# EAGLE design smartBadgeV1 (EAGLE 9.4.1)
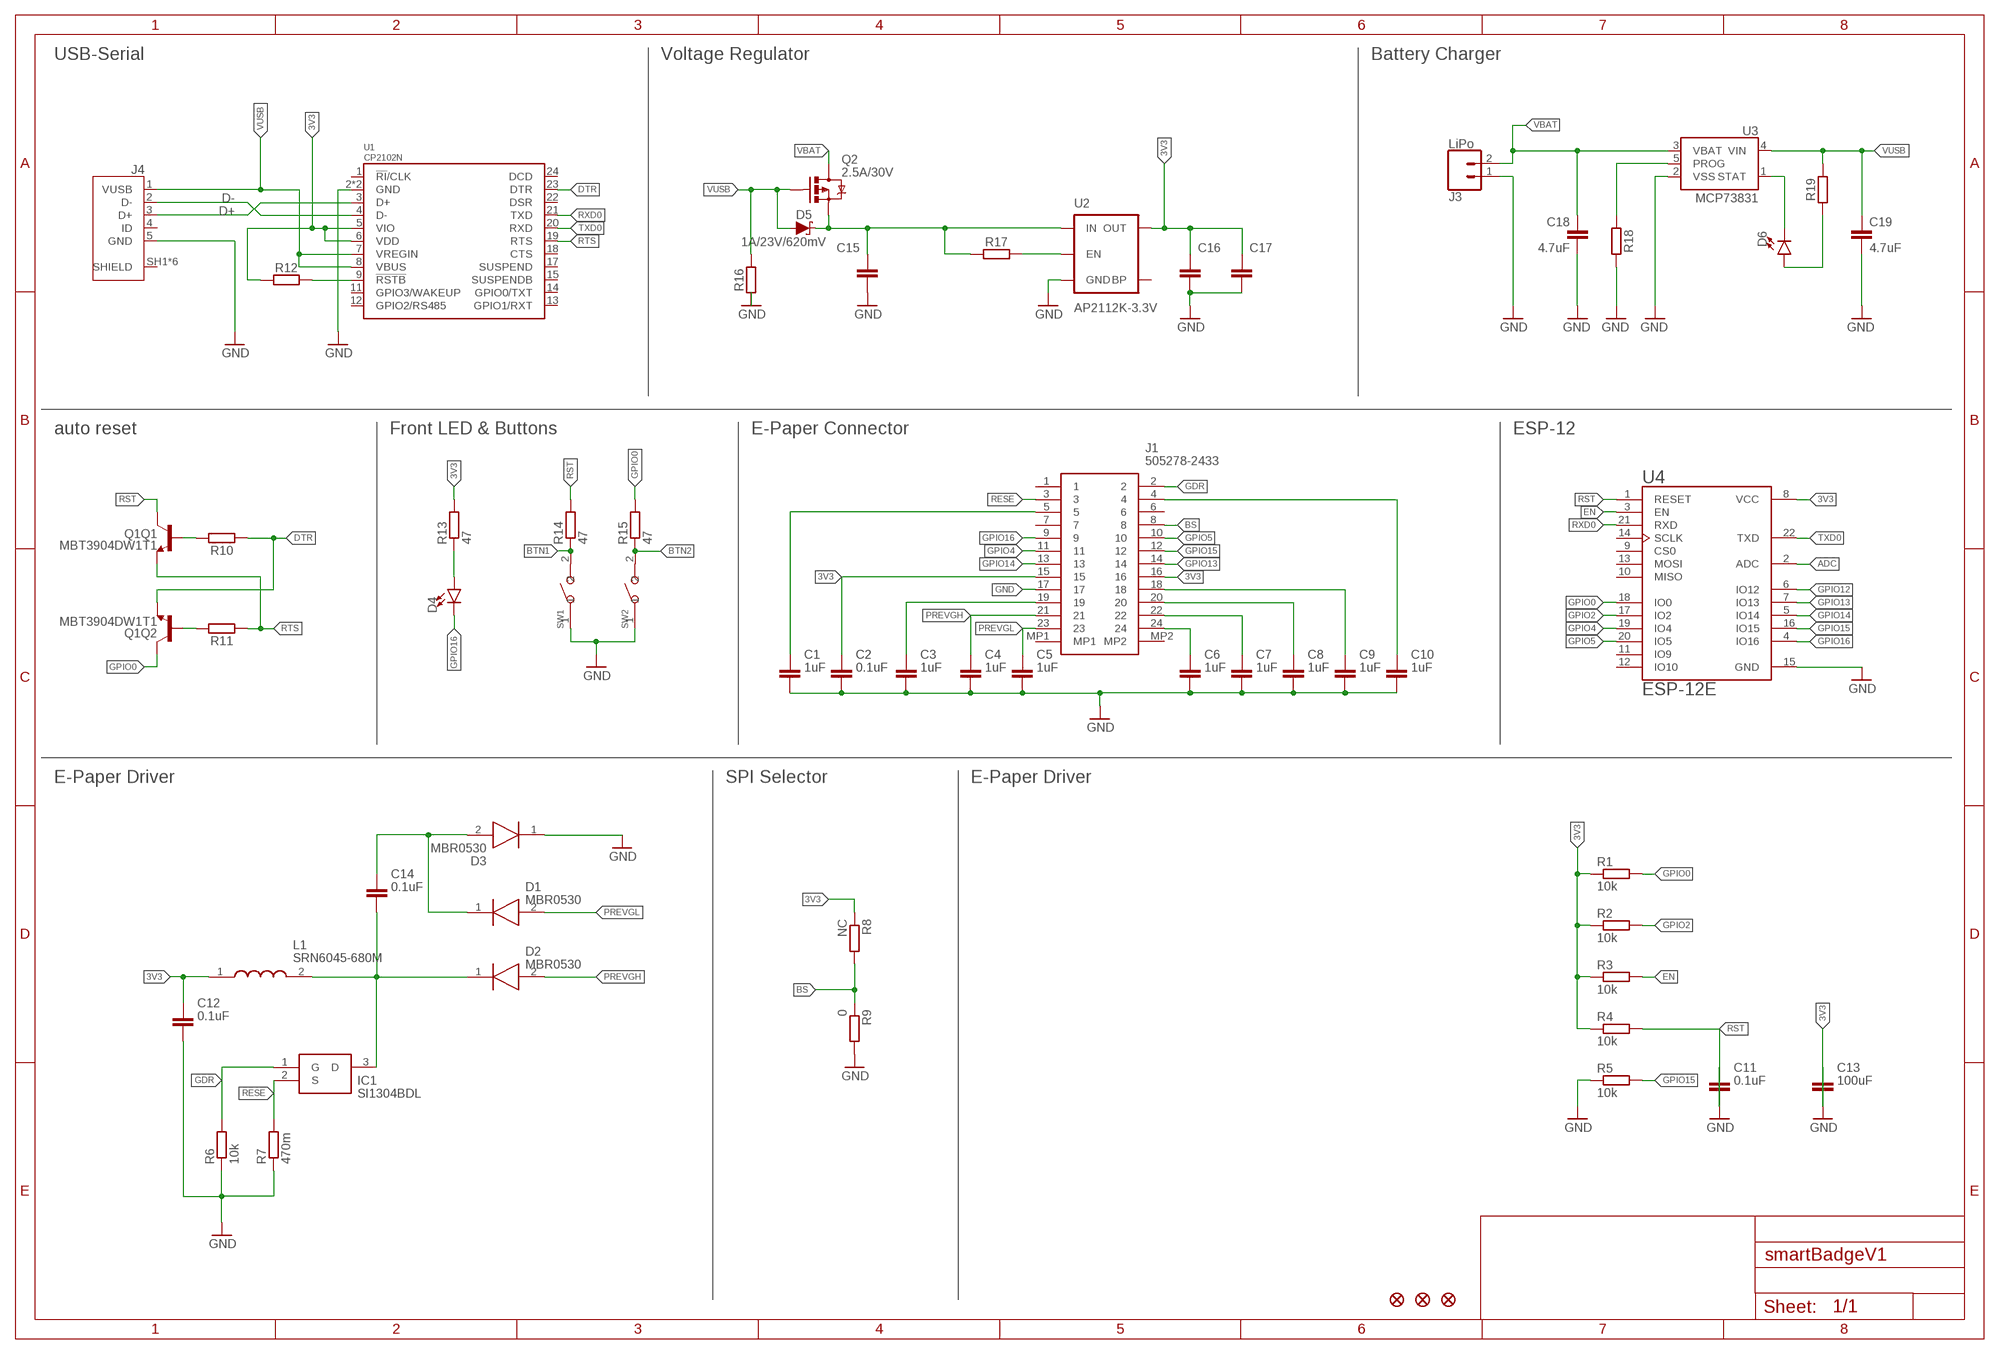
[diagram p0: schematic, sheet 1]

## Parts
C1  1uF  C-EUC0603  [C0603]
C2  0.1uF  C-EUC0603  [C0603]
C3  1uF  C-EUC0603  [C0603]
C4  1uF  C-EUC0603  [C0603]
C5  1uF  C-EUC0603  [C0603]
C6  1uF  C-EUC0603  [C0603]
C7  1uF  C-EUC0603  [C0603]
C8  1uF  C-EUC0603  [C0603]
C9  1uF  C-EUC0603  [C0603]
C10  1uF  C-EUC0603  [C0603]
C11  0.1uF  C-EUC0603  [C0603]
C12  0.1uF  C-EUC0603  [C0603]
C13  100uF  C-EUC1206  [C1206]
C14  0.1uF  C-EUC0603  [C0603]
C15  1uF  C-EUC0603  [C0603]
C16  1uF  C-EUC0603  [C0603]
C17  10uF  C-EUC0603  [C0603]
C18  4.7uF  4.7UF0603  [0603]
C19  4.7uF  4.7UF0603  [0603]
D1  MBR0530  [SOD3716X135N]
D2  MBR0530  [SOD3716X135N]
D3  MBR0530  [SOD3716X135N]
D4  led-blue-0603  LEDCHIP-LED0603  [CHIP-LED0603]
D5  1A/23V/620mV  DIODE-SCHOTTKY-BAT20J  [SOD-323]
D6  led-blue-0603  LEDCHIP-LED0603  [CHIP-LED0603]
FD1  FIDUCIAL1X2  [FIDUCIAL-1X2]
FD2  FIDUCIAL1X2  [FIDUCIAL-1X2]
FD3  FIDUCIAL1X2  [FIDUCIAL-1X2]
IC1  SI1304BDL  SI1304BDL-T1-E3  [SOT65P210X110-3N]
J1  505278-2433  [5052782433]
J3  LiPo  CONN_02-JST-2MM-SMT  [JST-2-SMD]
J4  10118192-0001LF  [AMPHENOL_10118192-0001LF]
L1  SRN6045-680M  [INDPM6060X470N]
Q1  MBT3904DW1T1  TRANS_NPN_DUAL-MBT3904DW1T1  [SC70-6]
Q2  2.5A/30V  MOSFET-PCHANNELDMG2307L  [SOT23-3@1]
R1  10k  R-EU_R0603  [R0603]
R2  10k  R-EU_R0603  [R0603]
R3  10k  R-EU_R0603  [R0603]
R4  10k  R-EU_R0603  [R0603]
R5  10k  R-EU_R0603  [R0603]
R6  10k  R-EU_R0603  [R0603]
R7  470m  R-EU_R0603  [R0603]
R8  NC  R-EU_R0603  [R0603]
R9  0  R-EU_R0603  [R0603]
R10  10k  R-EU_R0603  [R0603]
R11  10k  R-EU_R0603  [R0603]
R12  1k  R-EU_R0603  [R0603]
R13  47  R-EU_R0603  [R0603]
R14  47  R-EU_R0603  [R0603]
R15  47  R-EU_R0603  [R0603]
R16  10k  R-EU_R0603  [R0603]
R17  100K  R-EU_R0603  [R0603]
R18  2.0k  R-EU_R0603  [R0603]
R19  1k  R-EU_R0603  [R0603]
SW1  SMD-BUTTON(2P-3.0X2.5X1.2+0.4MM)-B3U-1000P-2P-SMD  [SW2-2.6-3.0X2.5X1.2+0.4MM]
SW2  SMD-BUTTON(2P-3.0X2.5X1.2+0.4MM)-B3U-1000P-2P-SMD  [SW2-2.6-3.0X2.5X1.2+0.4MM]
U1  CP2102N  [QFN24]
U2  AP2112K-3.3V  V_REG_LDOSMD  [SOT23-5]
U3  MCP73831  [SOT23-5]
U4  ESP-12E  ESP8266-12E/ESP-12E  [XCVR_ESP8266-12E/ESP-12E]

## Nets
3V3 [VDD]: C2.1 C12.1 C13.2 C16.1 C17.1 J1.15 J1.16 L1.1 R1.1 R2.1 R3.1 R4.1 R8.1 R12.1 R13.2 U1.5(VIO) U1.6(VDD) U2.5(OUT) U4.8(VCC)
ADC: U4.2(ADC)
BS: J1.8 R8.2 R9.1
BTN1: R14.1 SW1.2
BTN2: R15.1 SW2.2
CHG: D6.C U3.1(STAT)
D+: J4.3(D+) U1.3(D+)
D-: J4.2(D-) U1.4(D-)
DTR: Q1.1(Q2:E) R10.1 U1.23(DTR)
EN: R3.2 U4.3(EN)
EN1: R17.2 U2.3(EN)
GDR: IC1.1(G) J1.2 R6.2
GND [gnd]: C1.2 C2.2 C3.2 C4.2 C5.2 C6.2 C7.2 C8.2 C9.2 C10.2 C11.1 C12.2 C13.1 C15.2 C16.2 C17.2 C18.2 C19.2 D3.1(K) J1.17 J3.1 J4.5(GND) R5.1 R6.1 R7.1 R9.2 R16.1 R18.1 SW1.1 SW2.1 U1.2(GND) U1.PAD(GND) U2.2(GND) U3.2(VSS) U4.15(GND)
GPIO0: Q1.6(Q2:C) R1.2 R15.2 U4.18(IO0)
GPIO2: R2.2 U4.17(IO2)
GPIO4: J1.11 U4.19(IO4)
GPIO5: J1.10 U4.20(IO5)
GPIO12: U4.6(IO12)
GPIO13: J1.14 U4.7(IO13)
GPIO14: J1.13 U4.5(IO14)
GPIO15: J1.12 R5.2 U4.16(IO15)
GPIO16: D4.C J1.9 U4.4(IO16)
N$1: R12.2 U1.9(!RSTB)
N$4: D6.A R19.2
N$5: R18.2 U3.5(PROG)
N$6: Q1.5(Q1:B) R10.2
N$7: D4.A R13.1
N$15: C1.1 J1.5
N$16: C10.1 J1.4
N$17: C14.1 D1.1(K) D3.2(A)
N$18: C14.2 D2.1(K) IC1.3(D) L1.2
N$21: C15.1 D5.C Q2.2(S) R17.1 U2.1(IN)
N$22: Q1.2(Q2:B) R11.2
N$24: C9.1 J1.18
N$25: C8.1 J1.20
N$26: C7.1 J1.22
N$27: C6.1 J1.24
N$33: C3.1 J1.19
PREVGH: C4.1 D2.2(A) J1.21
PREVGL: C5.1 D1.2(A) J1.23
RESE: IC1.2(S) J1.3 R7.2
RST: C11.2 Q1.3(Q1:C) R4.2 R14.2 U4.1(RESET)
RTS: Q1.4(Q1:E) R11.1 U1.19(RTS)
RXD0: U1.21(TXD) U4.21(RXD)
TXD0: U1.20(RXD) U4.22(TXD)
VBAT [VDD]: C18.1 J3.2 Q2.3(D) U3.3(VBAT)
VUSB [VDD]: C19.1 D5.A J4.1(VUSB) Q2.1(G) R16.2 R19.1 U1.7(VREGIN) U1.8(VBUS) U3.4(VIN)
Unconnected: J1.1 J1.6 J1.7 J1.MP1 J1.MP2 J4.4(ID) J4.SH1(SHIELD) J4.SH2(SHIELD) J4.SH3(SHIELD) J4.SH4(SHIELD) J4.SH5(SHIELD) J4.SH6(SHIELD) U1.1(!RI!/CLK) U1.11(GPIO3/WAKEUP) U1.12(GPIO2/RS485) U1.13(GPIO1/RXT) U1.14(GPIO0/TXT) U1.15(SUSPENDB) U1.17(SUSPEND) U1.18(CTS) U1.22(DSR) U1.24(DCD) U2.4(BP) U4.9(CS0) U4.10(MISO) U4.11(IO9) U4.12(IO10) U4.13(MOSI) U4.14(SCLK)

## Notes on the sheet
- USB-Serial | Voltage Regulator | Battery Charger
- auto reset | Front LED & Buttons | E-Paper Connector | ESP-12
- E-Paper Driver | SPI Selector | E-Paper Driver

## Library data of the parts
C1-C17 = resistor:C-EU: CAPACITOR, European symbol
C18 C19 = SparkFun-Capacitors:4.7UF: 4.7µF ceramic capacitors A capacitor is a passive two-terminal electrical component used to store electrical energy temporarily in an electric field.; PROD_ID: CAP-08280
D1-D3 = SamacSys_Parts:MBR0530: ON SEMICONDUCTOR - MBR0530 - DIODE, SCHOTTKY, 0.5A, 30V, SOD-123 Source: Datasheet <https://www.mouser.com/datasheet/2/308/MBR0530-1301245.pdf>; DESCRIPTION: ON SEMICONDUCTOR - MBR0530 - DIODE, SCHOTTKY, 0.5A, 30V, SOD-123; HEIGHT: 1.35mm; MANUFACTURER_NAME: ON Semiconductor; MANUFACTURER_PART_NUMBER: MBR0530; MOUSER_PART_NUMBER: 512-MBR0530
D4 D6 = led:LED: LED OSRAM: - CHIPLED LG R971, LG N971, LY N971, LG Q971, LY Q971, LO R971, LY R971 LH N974, LH R974 LS Q976, LO Q976, LY Q976 LO Q996 - Hyper CHIPLED LW Q18S LB Q993, LB Q99A, LB R99A - SideLED LS A670, LO A670, LY A670, LG A670, LP A670 LB A673, LV A673, LT A673, LW A673 LH A674 LY A675 LS A676, LA A676, LO A676, LY A676, LW A676 LS A679, LY A679, LG A679 - Hyper Micro SIDELED® LS Y876, LA Y876, LO Y876, LY Y876 LT Y87S - SmartLED LW L88C, LW L88S LB L89C, LB L89S, LG L890 LS L89K, LO L89K, LY L89K LS L896, LA L896, LO L896, LY L896 - TOPLED LS T670, LO T670, LY T670, LG T670, LP T670 LSG T670, LSP T670, LSY T670, LOP T670, LYG T670 LG T671, LOG T671, LSG T671 LB T673, LV T673, LT T673, LW T673 LH T674 LS T676, LA T676, LO T676, LY T676, LB T676, LH T676, LSB T676, LW T676 LB T67C, LV T67C, LT T67C, LS T67K, LO T67K, LY T67K, LW E67C LS E67B, LA E67B, LO E67B, LY E67B, LB E67C, LV E67C, LT E67C LW T67C LS T679, LY T679, LG T679 LS T770, LO T770, LY T770, LG T770, LP T770 LB T773, LV T773, LT T773, LW T773 LH T774 LS E675, LA E675, LY E675, LS T675 LS T776, LA T776, LO T776, LY T776, LB T776 LHGB T686 LT T68C, LB T68C - Hyper Mini TOPLED® LB M676 - Mini TOPLED Santana® LG M470 LS M47K, LO M47K, LY M47K Source: http://www.osram.convergy.de LUXEON: - LUMILED® LXK2-PW12-R00, LXK2-PW12-S00, LXK2-PW14-U00, LXK2-PW14-V00 LXK2-PM12-R00, LXK2-PM12-S00, LXK2-PM14-U00 LXK2-PE12-Q00, LXK2-PE12-R00, LXK2-PE12-S00, LXK2-PE14-T00, LXK2-PE14-U00 LXK2-PB12-K00, LXK2-PB12-L00, LXK2-PB12-M00, LXK2-PB14-N00, LXK2-PB14-P00, LXK2-PB14-Q00 LXK2-PR12-L00, LXK2-PR12-M00, LXK2-PR14-Q00, LXK2-PR14-R00 LXK2-PD12-Q00, LXK2-PD12-R00, LXK2-PD12-S00 LXK2-PH12-R00, LXK2-PH12-S00 LXK2-PL12-P00, LXK2-PL12-Q00, LXK2-PL12-R00 Source: www.luxeon.com KINGBRIGHT: KA-3528ASYC Source: www.kingbright.com
D5 = SparkFun-DiscreteSemi:DIODE-SCHOTTKY: Schottky diode A Schottky diode is a semiconductor diode which has a low forward voltage drop and a very fast switching action.; PROD_ID: DIO-11623
FD1-FD3 = SparkFun-Aesthetics:FIDUCIAL: Fiducial Alignment Points Point-of-reference for pick-and-place machines and other optical instruments.
IC1 = SamacSys_Parts:SI1304BDL-T1-E3: SI1304BDL-T1-E3, N-channel MOSFET Transistor 0.85 A 30 V, 3-Pin SC-70 Source: Datasheet <https://componentsearchengine.com/Datasheets/1/SI1304BDL-T1-E3.pdf>; DESCRIPTION: SI1304BDL-T1-E3, N-channel MOSFET Transistor 0.85 A 30 V, 3-Pin SC-70; HEIGHT: 1.1mm; MANUFACTURER_NAME: Vishay; MANUFACTURER_PART_NUMBER: SI1304BDL-T1-E3; MOUSER_PART_NUMBER: 781-SI1304BDL-E3; MOUSER_PRICE-STOCK: https://www.mouser.com/Search/Refine.aspx?Keyword=781-SI1304BDL-E3
J1 = SamacSys_Parts:505278-2433: FFC & FPC Connectors 0.5 FFC ZIF BTM CONT 24Ckt R/A FRONT FLIP Source: Datasheet <https://componentsearchengine.com/Datasheets/1/505278-2433.pdf>; DESCRIPTION: FFC & FPC Connectors 0.5 FFC ZIF BTM CONT 24Ckt R/A FRONT FLIP; HEIGHT: 2.15mm; MANUFACTURER_NAME: Molex; MANUFACTURER_PART_NUMBER: 505278-2433; MOUSER_PART_NUMBER: 538-505278-2433; MOUSER_PRICE-STOCK: https://www.mouser.com/Search/Refine.aspx?Keyword=538-505278-2433
J3 = SparkFun-Connectors:CONN_02: Multi connection point. Often used as Generic Header-pin footprint for 0.1 inch spaced/style header connections On any of the 0.1 inch spaced packages, you can populate with these: Break Away Headers - Straight <https://www.sparkfun.com/products/116> (PRT-00116) Break Away Male Headers - Right Angle <https://www.sparkfun.com/products/553> (PRT-00553) Female Headers <https://www.sparkfun.com/products/115> (PRT-00115) Break Away Headers - Machine Pin <https://www.sparkfun.com/products/117> (PRT-00117) Break Away Female Headers - Swiss Machine Pin <https://www.sparkfun.com/products/743> (PRT-00743) For SCREWTERMINALS and SPRING TERMINALS visit here: Screw Terimnals on SparkFun.com <https://www.sparkfun.com/search/results?term=Screw+Terminals> (5mm/3.5mm/2.54mm spacing) This device is also useful as a general connection point to wire up your design to another part of your project. Our various solder wires solder well into these plated through hole pads. Hook-Up Wire - Assortment (Stranded, 22 AWG) <https://www.sparkfun.com/products/11375> (PRT-11375) Hook-Up Wire - Assortment (Solid Core, 22 AWG) <https://www.sparkfun.com/products/11367> (PRT-11367) View the entire wire category on our website here <https://www.sparkfun.com/categories/141> Special notes: Molex polarized connector foot print use with: PRT-08233 with associated crimp pins and housings. 2.54_SCREWTERM for use with PRT-10571. 3.5mm Screw Terminal footprints for PRT-08084 5mm Screw Terminal footprints for use with PRT-08432; PROD_ID: CONN-11443
J4 = 10118192-0001LF:10118192-0001LF: Single Port 5 Contact Horizontal Right Angle Shielded Micro B USB 2.0 Connector; AVAILABILITY: Unavailable; DESCRIPTION: Single Port 5 Contact Horizontal Right Angle Shielded Micro B USB 2.0 Connector; MF: Amphenol ICC; MP: 10118192-0001LF; PACKAGE: None; PRICE: None
L1 = SamacSys_Parts:SRN6045-680M: Bourns SRN6045 Series Type 6045 Shielded Wire-wound SMD Inductor with a Ferrite Core, 68 H +/-20% Wire-Wound 1A Idc Source: Datasheet <https://www.mouser.de/datasheet/2/54/rn6045-1391386.pdf>; DESCRIPTION: Bourns SRN6045 Series Type 6045 Shielded Wire-wound SMD Inductor with a Ferrite Core, 68 H +/-20% Wire-Wound 1A Idc; HEIGHT: 4.7mm; MANUFACTURER_NAME: Bourns; MANUFACTURER_PART_NUMBER: SRN6045-680M
Q1 = SparkFun-DiscreteSemi:TRANS_NPN_DUAL: Dual NPN Transistors in Single Package The MBT3904W1 puts two general purpose 3904 NPN transistors in a single package. Datasheet <http://www.onsemi.com/pub_link/Collateral/MBT3904DW1T1-D.PDF> SparkFun Products: SparkFun ESP32 Thing <https://www.sparkfun.com/products/13907>; PROD_ID: TRANS-13337
Q2 = SparkFun-DiscreteSemi:MOSFET-PCHANNEL: Generic PMOSFET IRLML2244 - TRANS-11153 (SOT-23 -20V -4.3A) (1.Gate 2.Source 3.Drain) FQP27P06 - COM-10349 <http://www.sparkfun.com/products/10349> (TO-220 -60V -27A) (1.Gate 2.Source 3.Drain); PROD_ID: TRANS-11308
R1-R19 = resistor:R-EU_: RESISTOR, European symbol
SW1 = OPL_Switch:SMD-BUTTON(2P-3.0X2.5X1.2+0.4MM): 311020047; MPN: B3U-1000P-2P-SMD; ORDERNO: B3U-1000P; VALUE: B3U-1000P-2P-SMD
SW2 = OPL_Switch:SMD-BUTTON(2P-3.0X2.5X1.2+0.4MM): 311020047; MPN: B3U-1000P-2P-SMD; VALUE: B3U-1000P-2P-SMD
U1 = SparkFun-IC-Comms:CP2102N; PROD_ID: IC-14020
U2 = SparkFun-PowerIC:V_REG_LDO: Voltage Regulator LDO Standard 150mA LDO voltage regulator in SOT-23 layout. Micrel part MIC5205. BP (by-pass) pin is used to lower output noise with 470pF cap.; PROD_ID: VREG-12457
U3 = SparkFun-PowerIC:MCP73831: Miniature single cell, fully integrated Li-Ion, Li-polymer charge management controller http://ww1.microchip.com/downloads/en/DeviceDoc/20001984g.pdf IC-09995; PROD_ID: IC-09995
U4 = ESP8266-12E_ESP-12E:ESP8266-12E/ESP-12E: ESP-12E WiFi Module; AVAILABILITY: Unavailable; DESCRIPTION: This WiFi module has a 32-bit MCU micro and clock speeds supporting 80 MHz or 160 MHz. Supports the RTOS and integrated Wi-Fi MAC/BB/RF/PA/LNA, and has an on-board antenna.; MF: AI-Thinker; MP: ESP8266-12E/ESP-12E; PACKAGE: None; PRICE: None

## Net classes
0 default: width 0.127 mm
1 gnd: width 0.381 mm
2 VDD: width 0.381 mm

## Board
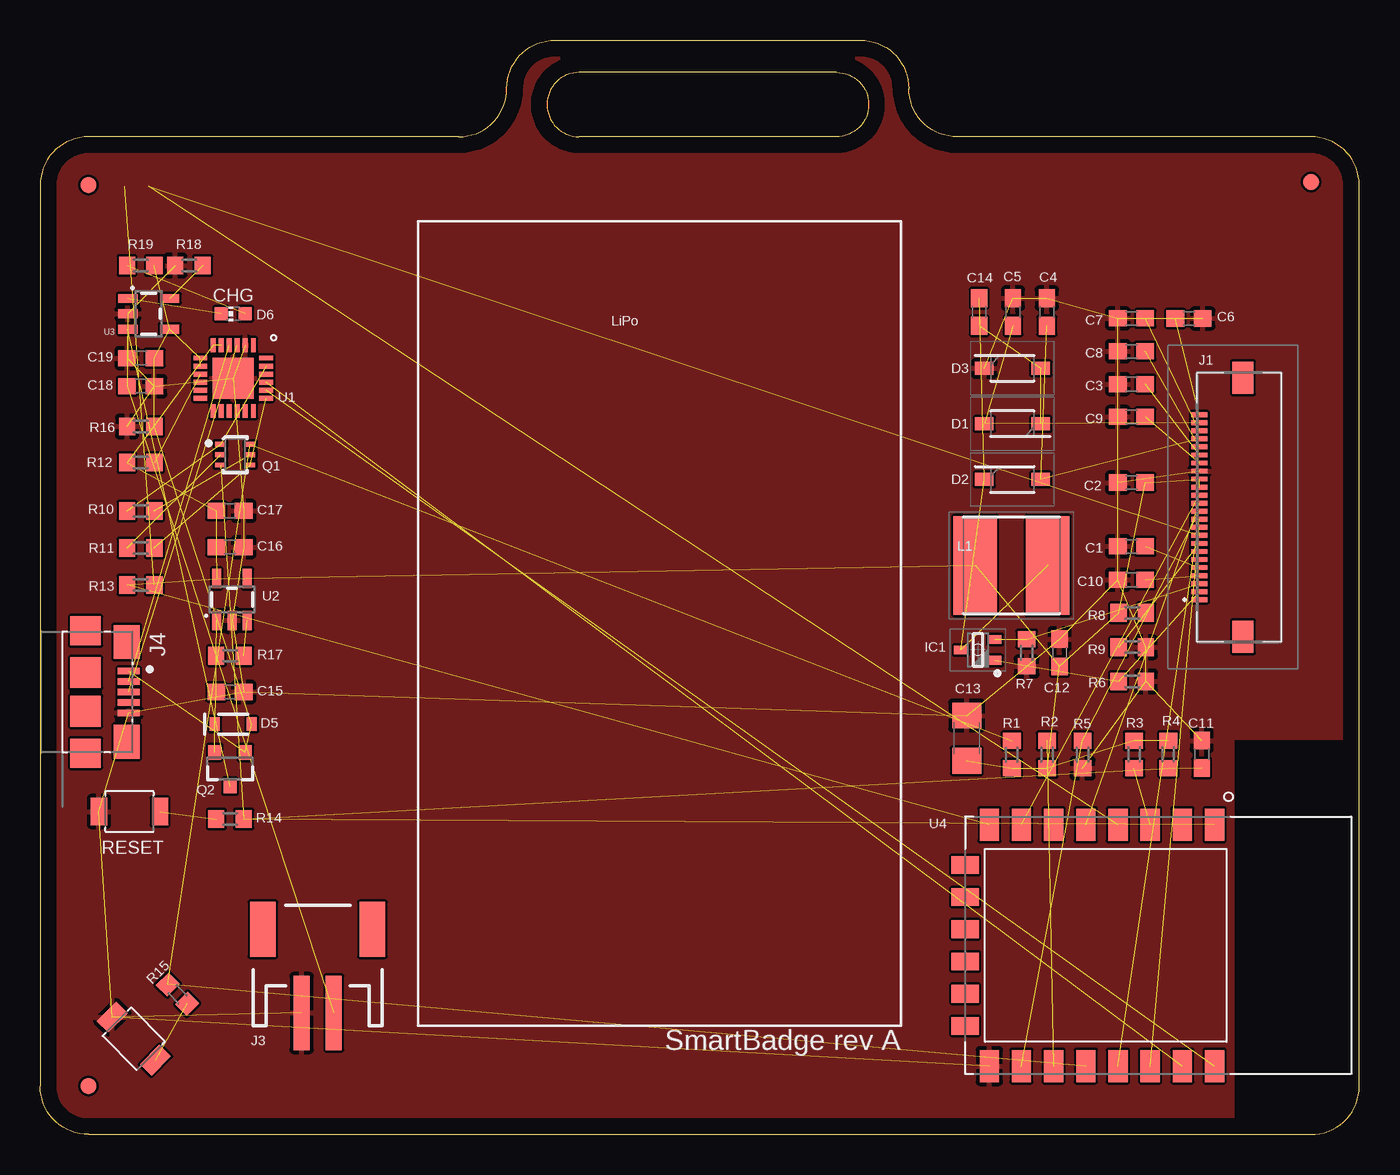
[diagram p1: board, top side]
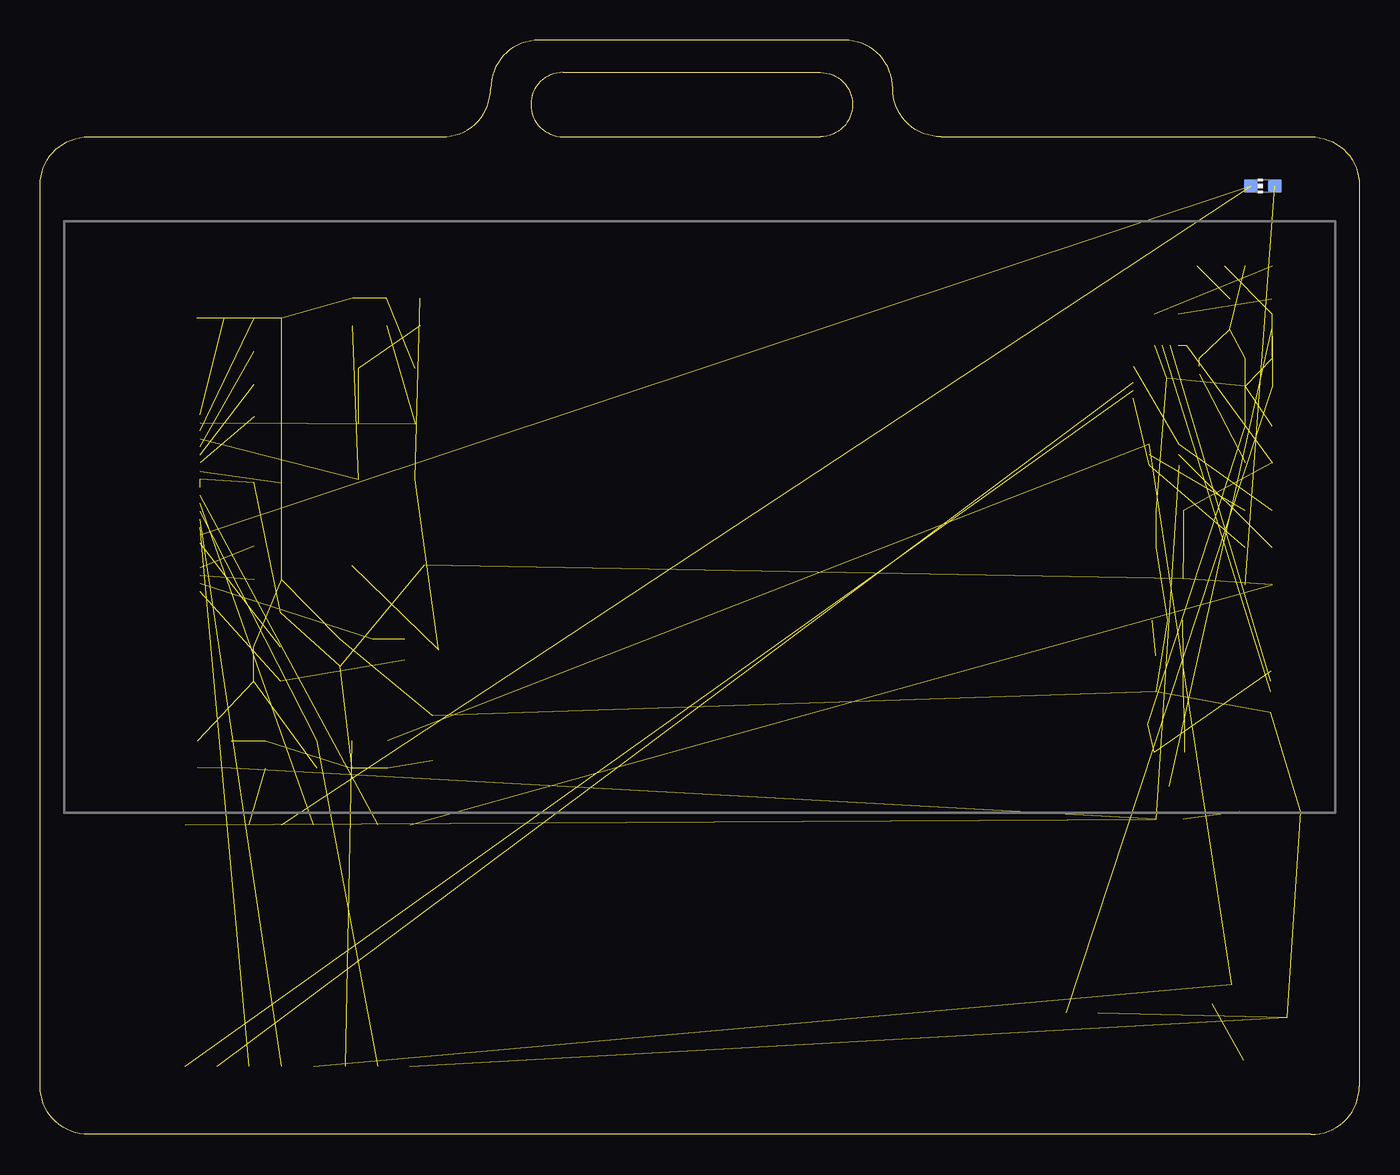
[diagram p2: board, bottom side, seen from below]

Size 82 x 68 mm. Coordinates in mm from the lower left corner, seen from the top.
Outline: 3,0 79,0 arc90 82,3 82,59 arc90 79,62 57,62 arc-90 54,65 arc90 51,68 32,68 arc90 29,65 arc-90 26,62 3,62 arc90 0,59 0,3 arc90 3,0
Outline: 49.5,62 33.5,62 arc-180 33.5,66 49.5,66 arc-180 49.5,62
Copper layers (1*16): Top 0.035mm / dielectric 1.5mm / Bottom 0.035mm
Design rules "default": minimum track width 6mil, minimum drill 0.35mm, track to track 6mil, track to pad 6mil, pad to pad 6mil, via to via 6mil, smd to smd 6mil, copper to edge 40mil, drill to drill 6mil, minimum pad ring 10mil, minimum via ring 8mil, stop-mask expansion 4mil, vias tented up to drill 0mil, thermal gap 10mil
tRestrict: area 74.2,-0.8 to 83.2,24.5
bRestrict: area 74.2,-0.8 to 83.2,24.5

### Footprints (pad centres in the part's own frame; a part is rotated, then mirrored left to right if it is on the bottom)
C0603 = smd 1.1 x 1: 1 -0.85,0; 2 0.85,0
C1206 = smd 1.6 x 1.8: 1 -1.4,0; 2 1.4,0
0603 = smd 1.1 x 1: 1 -0.85,0; 2 0.85,0
SOD3716X135N = smd 1.15 x 0.8: 1 -1.75,0; 2 1.75,0
CHIP-LED0603 = smd 0.8 x 0.8: A 0,-0.75; C 0,0.75
SOD-323 = smd 0.63 x 0.83: A 1.15,0; C -1.15,0
FIDUCIAL-1X2 = smd 1 x 1: 1 0,0
SOT65P210X110-3N = smd 0.85 x 0.55: 1 -1.05,0.65; 2 -1.05,-0.65; 3 1.05,0
5052782433 = smd 0.3 x 1: 1 -5.75,2.475; 2 -5.25,2.475; 3 -4.75,2.475; 4 -4.25,2.475; 5 -3.75,2.475; 6 -3.25,2.475; 7 -2.75,2.475; 8 -2.25,2.475; 9 -1.75,2.475; 10 -1.25,2.475; 11 -0.75,2.475; 12 -0.25,2.475; 13 0.25,2.475; 14 0.75,2.475; 15 1.25,2.475; 16 1.75,2.475; 17 2.25,2.475; 18 2.75,2.475; 19 3.25,2.475; 20 3.75,2.475; 21 4.25,2.475; 22 4.75,2.475; 23 5.25,2.475; 24 5.75,2.475 | smd 2 x 1.3: MP1 -8.05,-0.225; MP2 8.05,-0.225
JST-2-SMD = smd 1 x 4.6: 1 -1,-3.7; 2 1,-3.7 | smd 1.6 x 3.4: NC1 -3.4,1.5; NC2 3.4,1.5
AMPHENOL_10118192-0001LF = smd 0.4 x 1.35: 1 -1.3,0; 2 -0.65,0; 3 0,0; 4 0.65,0; 5 1.3,0 | smd 2.1 x 1.6: SH1 -3.1,-0.125; SH2 3.1,-0.125 | smd 1.8 x 1.9: SH3 -3.8,-2.675; SH6 3.8,-2.675 | smd 1.9 x 1.9: SH4 -1.2,-2.675; SH5 1.2,-2.675
INDPM6060X470N = smd 2.7 x 6.1: 1 -2.25,0; 2 2.25,0
SC70-6 = smd 0.3 x 0.66: 1 -0.65,-0.92; 2 0,-0.92; 3 0.65,-0.92; 4 0.65,0.92; 5 0,0.92; 6 -0.65,0.92
SOT23-3@1 = smd 0.8 x 0.9: 1 -0.95,-1; 2 0.95,-1; 3 0,1.1
R0603 = smd 1 x 1.1: 1 -0.85,0; 2 0.85,0
SW2-2.6-3.0X2.5X1.2+0.4MM = smd 1 x 1.7: 1 -1.9,0; 2 1.9,0
QFN24 = smd 0.85 x 0.3: 1 -2.05,1.25; 2 -2.05,0.75; 3 -2.05,0.25; 4 -2.05,-0.25; 5 -2.05,-0.75; 6 -2.05,-1.25; 13 2.05,-1.25; 14 2.05,-0.75; 15 2.05,-0.25; 16 2.05,0.25; 17 2.05,0.75; 18 2.05,1.25 | smd 0.3 x 0.85: 7 -1.25,-2.05; 8 -0.75,-2.05; 9 -0.25,-2.05; 10 0.25,-2.05; 11 0.75,-2.05; 12 1.25,-2.05; 19 1.25,2.05; 20 0.75,2.05; 21 0.25,2.05; 22 -0.25,2.05; 23 -0.75,2.05; 24 -1.25,2.05 | smd 2.55 x 2.55: PAD 0,0
SOT23-5 = smd 0.55 x 1.2: 1 -0.95,-1.3; 2 0,-1.3; 3 0.95,-1.3; 4 0.95,1.3; 5 -0.95,1.3
XCVR_ESP8266-12E/ESP-12E = smd 2 x 1.2: 1 -7.5,7; 2 -7.5,5; 3 -7.5,3; 4 -7.5,1; 5 -7.5,-1; 6 -7.5,-3; 7 -7.5,-5; 8 -7.5,-7; 15 7.5,-7; 16 7.5,-5; 17 7.5,-3; 18 7.5,-1; 19 7.5,1; 20 7.5,3; 21 7.5,5; 22 7.5,7 | smd 1.1 x 1.7: 9 -5,-8.5; 10 -3,-8.5; 11 -1,-8.5; 12 1,-8.5; 13 3,-8.5; 14 5,-8.5

### Placement (x,y rotation side)
C1  67.84,36.55 180 top
C2  67.84,40.51 180 top
C3  67.84,46.63 180 top
C4  62.58,51.11 90 top
C5  60.48,51.11 90 top
C6  71.41,50.71 0 top
C7  67.84,50.71 180 top
C8  67.84,48.67 180 top
C9  67.84,44.59 180 top
C10  67.84,34.47 180 top
C11  72.2,23.63 270 top
C12  63.37,29.94 90 top
C13  57.6,24.63 270 top
C14  58.37,51.11 90 top
C15  11.8,27.5 0 top
C16  11.8,36.5 0 top
C17  11.8,38.75 0 top
C18  6.25,46.5 0 top
C19  6.25,48.25 180 top
D1  60.44,44.16 180 top
D2  60.44,40.71 0 top
D3  60.44,47.61 0 top
D4  6,58.94 90 bottom
D5  12,25.5 0 top
D6  12,51 90 top
FD1  3,59 0 top
FD2  3,3 0 top
FD3  79.01,59.19 0 top
IC1  58.29,30.11 180 top
J1  74.54,38.98 90 top
J3  17.25,11.25 0 top
J4  5.5,27.5 270 top
L1  60.38,35.36 0 top
Q1  12.13,42.25 270 top
Q2  11.8,22.75 180 top
R1  60.4,23.61 90 top
R2  62.6,23.61 90 top
R3  68,23.62 270 top
R4  70.12,23.62 270 top
R5  64.8,23.61 90 top
R6  67.89,28.15 180 top
R7  61.33,29.94 90 top
R8  67.89,32.42 0 top
R9  67.89,30.28 0 top
R10  6.25,38.75 0 top
R11  6.25,36.45 180 top
R12  6.25,41.75 0 top
R13  6.25,34.15 180 top
R14  11.8,19.6 0 top
R15  8.54,8.72 135 top
R16  6.25,44 0 top
R17  11.8,29.75 0 top
R18  9.25,54 0 top
R19  6.25,54 180 top
SW1  5.55,20.07 0 top
SW2  5.82,5.95 315 top
U1  12,47 270 top
U2  11.92,33.25 0 top
U3  6.75,51 270 top
U4  66,11.75 270 top

### Tracks (layer width: path | path; a pad name or v marks a point on that pad's centre or on a via)
3V3  (18 unrouted)
BS  (2 unrouted)
BTN1  (1 unrouted)
BTN2  (1 unrouted)
CHG  (1 unrouted)
D+  (1 unrouted)
D-  (1 unrouted)
DTR  (2 unrouted)
EN  (1 unrouted)
EN1  (1 unrouted)
GDR  (2 unrouted)
GND  (34 unrouted)
  pour Top: -2,70 -2,-2.5 84,-2.5 84,70
GPIO0  (3 unrouted)
GPIO2  (1 unrouted)
GPIO4  (1 unrouted)
GPIO5  (1 unrouted)
GPIO13  (1 unrouted)
GPIO14  (1 unrouted)
GPIO15  (2 unrouted)
GPIO16  (2 unrouted)
N$1  (1 unrouted)
N$4  (1 unrouted)
N$5  (1 unrouted)
N$6  (1 unrouted)
N$7  (1 unrouted)
N$15  (1 unrouted)
N$16  (1 unrouted)
N$17  (2 unrouted)
N$18  (3 unrouted)
N$21  (4 unrouted)
N$22  (1 unrouted)
N$24  (1 unrouted)
N$25  (1 unrouted)
N$26  (1 unrouted)
N$27  (1 unrouted)
N$33  (1 unrouted)
PREVGH  (2 unrouted)
PREVGL  (2 unrouted)
RESE  (2 unrouted)
RST  (4 unrouted)
RTS  (2 unrouted)
RXD0  (1 unrouted)
TXD0  (1 unrouted)
VBAT  (3 unrouted)
VUSB  (8 unrouted)

### Text on the board
tPlace: LiPo
tNames: CHG | RESET | SmartBadge rev A